# Altium schematic sheet CtrlCarbinBoard_Common.SchDoc
size A3
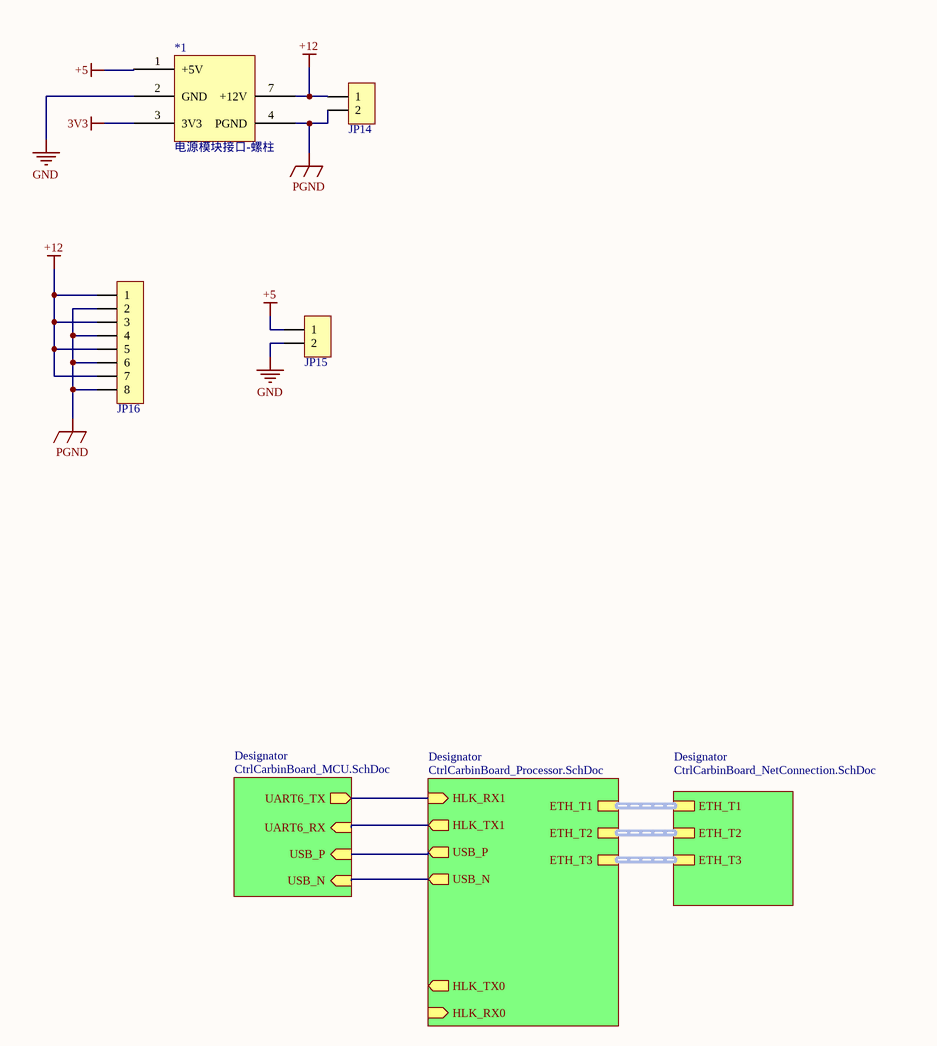
[diagram p0: CtrlCarbinBoard_Common.SchDoc]

## Parts
*1  电源模块接口-螺柱  [螺柱-座 5]
JP14  HDR-1X2  [KF128-5.08-2P]  (value not drawn)
JP15  HDR-1X2  [KF128-5.08-2P]  (value not drawn)
JP16  HDR-1X8  [KF128-5.08-8P]  (value not drawn)

## Sub-sheets
Designator = CtrlCarbinBoard_MCU.SchDoc: UART6_TX (out), USB_P (in), USB_N (in), UART6_RX (in)
Designator = CtrlCarbinBoard_NetConnection.SchDoc: ETH_T2 (harness ETH_T2), ETH_T3 (harness ETH_T3), ETH_T1 (harness ETH_T1)
Designator = CtrlCarbinBoard_Processor.SchDoc: HLK_TX0 (out), USB_P (out), HLK_RX1 (in), HLK_RX0 (in), USB_N (out), HLK_TX1 (out), ETH_T2 (harness ETH_T2), ETH_T3 (harness ETH_T3), ETH_T1 (harness ETH_T1)

## Nets
3V3: *1.3(3V3)
+5: *1.1(+5V) JP15.1
+12: *1.7(+12V) JP14.1 JP16.1 JP16.3 JP16.5 JP16.7
GND: *1.2(GND) JP15.2
PGND: *1.4(PGND) JP14.2 JP16.2 JP16.4 JP16.6 JP16.8
(unnamed): sheet Designator/UART6_TX, sheet Designator/HLK_RX1
(unnamed): sheet Designator/USB_P, sheet Designator/USB_P
(unnamed): sheet Designator/USB_N, sheet Designator/USB_N
(unnamed): sheet Designator/UART6_RX, sheet Designator/HLK_TX1

## Library data of the parts
JP14 JP15 = Header 2: 2P接插件; 版权归属: 源创客; BOM名称: 2P接插件; 学习资源: www.ooocke.com
JP16 = Header 8: 8P接插件; 版权归属: 源创客; BOM名称: 8P接插件; 学习资源: www.ooocke.com